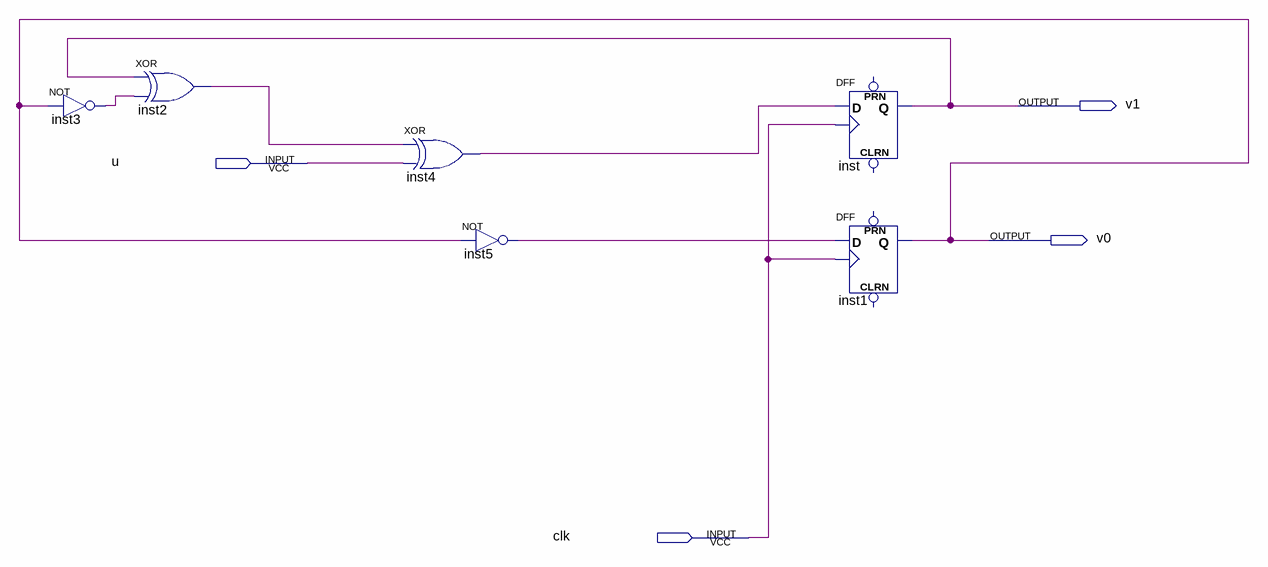
[diagram p0: schematic sheet]
// Quartus schematic 2bitCounter.bdf as structural Verilog: 6 symbols, 4 pins
module \2bitCounter  (
  input  u,
  input  clk,
  output v1,
  output v0
);

  wire inst2_out, inst3_out, inst4_out, inst5_out;

  not inst3 (inst3_out, v0);
  xor inst2 (inst2_out, v1, inst3_out);
  xor inst4 (inst4_out, inst2_out, u);
  not inst5 (inst5_out, v0);
  DFF inst (.CLK(clk), .D(inst4_out), .Q(v1));  // open: CLRN, PRN
  DFF inst1 (.CLK(clk), .D(inst5_out), .Q(v0));  // open: CLRN, PRN
endmodule
